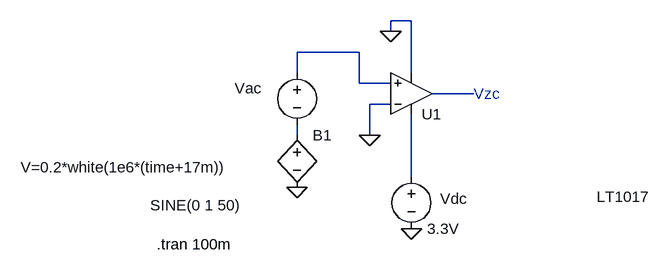
[diagram p0: schematic zcd2.asc]
zcd2.asc, the LTspice schematic file:
Version 4
SHEET 1 880 680
WIRE 144 32 112 32
WIRE 112 48 112 32
WIRE 64 80 -32 80
WIRE -32 112 -32 80
WIRE 144 112 144 32
WIRE 64 128 64 80
WIRE 112 128 64 128
WIRE 240 144 176 144
WIRE 112 160 80 160
WIRE -32 208 -32 192
WIRE 80 208 80 160
WIRE 144 272 144 176
FLAG -32 288 0
FLAG 144 352 0
FLAG 80 208 0
FLAG 112 48 0
SYMBOL Comparators\\LT1017 144 144 M180
WINDOW 3 285 -159 Left 2
SYMATTR InstName U1
SYMBOL voltage -32 96 R0
WINDOW 0 -96 40 Left 2
WINDOW 3 -226 220 Left 2
WINDOW 123 0 0 Left 0
WINDOW 39 0 0 Left 0
SYMATTR InstName Vac
SYMATTR Value SINE(0 1 50)
SYMBOL voltage 144 256 R0
WINDOW 0 44 50 Left 2
WINDOW 123 0 0 Left 0
WINDOW 39 0 0 Left 0
SYMATTR InstName Vdc
SYMATTR Value 3.3V
SYMBOL bv -32 192 R0
WINDOW 3 -425 65 Left 2
SYMATTR InstName B1
SYMATTR Value V=0.2*white(1e6*(time+17m))
TEXT -248 376 Left 2 !.tran 100m
TEXT 240 144 Left 2 ;Vzc

The netlist it stands for:
* zcd2.asc
XU1 N001 0 N004 0 N002 LT1017  ; pins In+ In- V+ V- OUT
Vac N001 N003 SINE(0 1 50)
Vdc N004 0 3.3V
B1 N003 0 V=0.2*white(1e6*(time+17m))
.tran 100m
* Vzc
.backanno
.end